# Altium schematic sheet MS5611.SchDoc
size A4
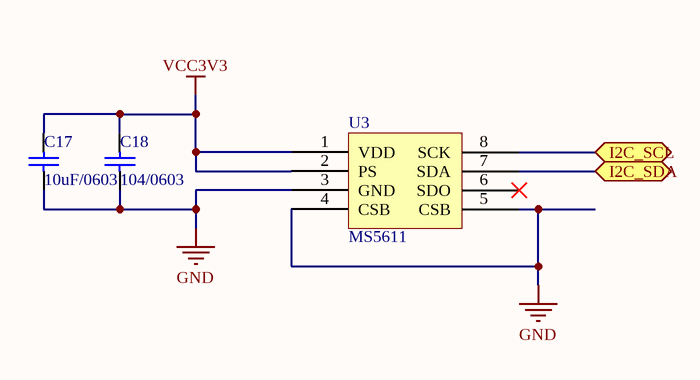
[diagram p0: MS5611.SchDoc]

## Parts
C17  10uF/0603  [C0603]
C18  104/0603  [C0603]
U3  MS5611  [MS5611]

## Ports
I2C_SCL, I2C_SDA

## Nets
GND: C17.1 C18.1 U3.3(GND) U3.4(CSB) U3.5(CSB)
VCC3V3: C17.2 C18.2 U3.1(VDD) U3.2(PS)
I2C_SCL: U3.8(SCK) ; port I2C_SCL
I2C_SDA: U3.7(SDA) ; port I2C_SDA

Not connected (* = marked no-connect by the designer): U3 6(SDO)*

## Library data of the parts
C17 C18 = CAP: 无极性贴片电容
U3 = MS5611: barometer